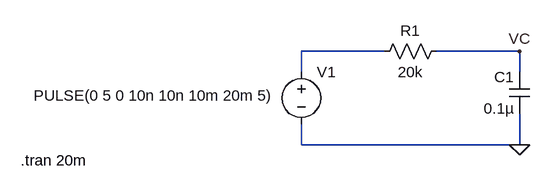
[diagram p0: schematic RC_Circuit.asc]
RC_Circuit.asc, the LTspice schematic file:
Version 4.1
SHEET 1 880 680
WIRE -16 160 -144 160
WIRE 192 160 64 160
WIRE -144 192 -144 160
WIRE 192 192 192 160
WIRE -144 304 -144 272
WIRE 192 304 192 256
WIRE 192 304 -144 304
FLAG 192 304 0
FLAG 192 160 VC
SYMBOL res 80 144 R90
WINDOW 0 0 56 VBottom 2
WINDOW 3 32 56 VTop 2
SYMATTR InstName R1
SYMATTR Value 20k
SYMBOL cap 208 256 R180
WINDOW 0 24 56 Left 2
WINDOW 3 24 8 Left 2
SYMATTR InstName C1
SYMATTR Value 0.1µ
SYMBOL voltage -144 176 R0
WINDOW 3 -41 52 Right 2
WINDOW 123 0 0 Left 0
WINDOW 39 0 0 Left 0
SYMATTR InstName V1
SYMATTR Value PULSE(0 5 0 10n 10n 10m 20m 5)
TEXT -576 328 Left 2 !.tran 20m

The netlist it stands for:
* RC_Circuit.asc
R1 VC N001 20k
C1 0 VC 0.1µ
V1 N001 0 PULSE(0 5 0 10n 10n 10m 20m 5)
.tran 20m
.backanno
.end